# EAGLE design fuelboxmp3 (EAGLE 6.4)
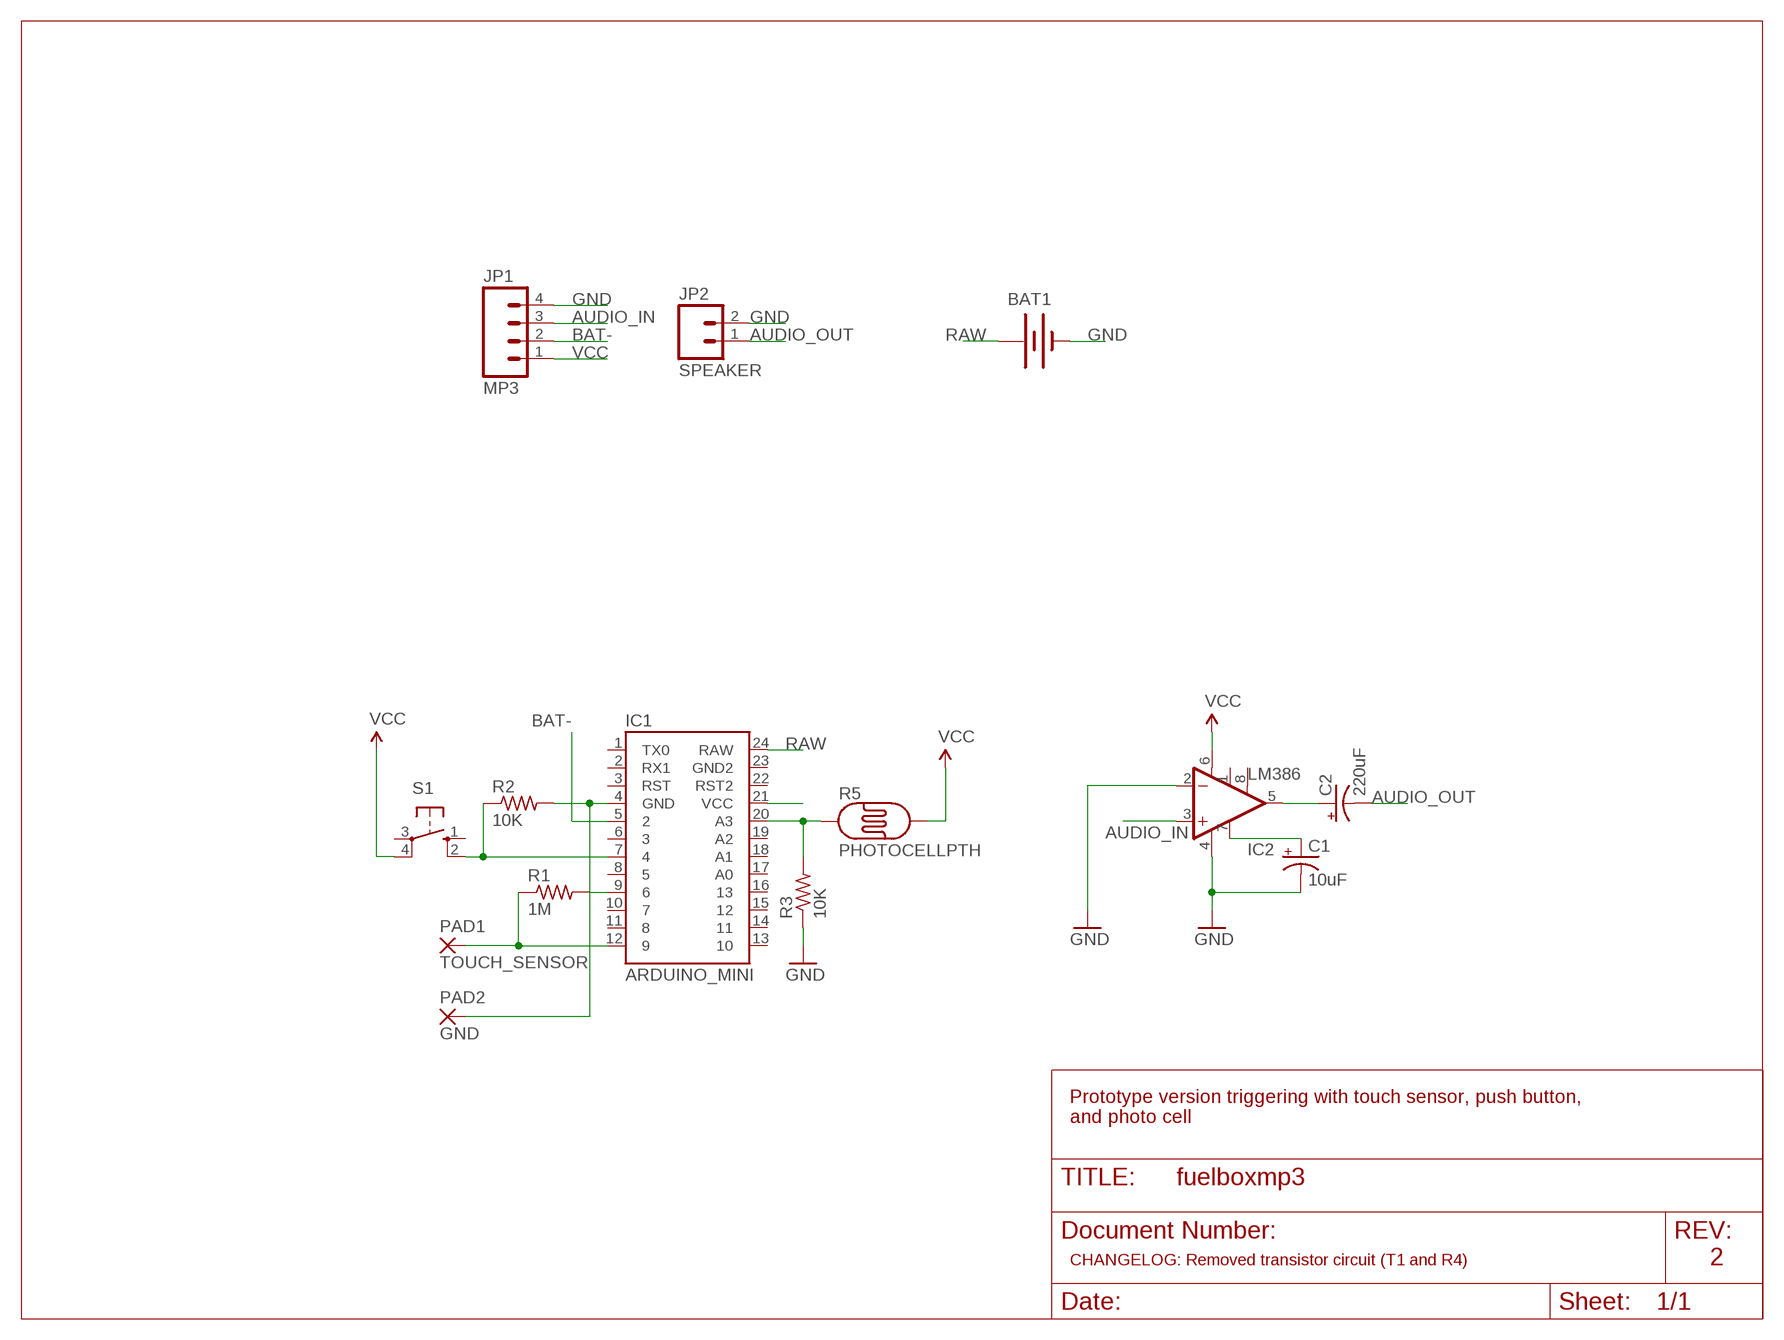
[diagram p0: schematic, sheet 1]

## Parts
BAT1  BATTERY1100  [LIPO-1100MAH]
C1  10uF  CPOL-USE2.5-5  [E2,5-5]
C2  220uF  CPOL-USE2.5-6  [E2,5-6]
IC1  ARDUINO_MINI  [ARDUINO_MINI]
IC2  LM386  [DIP08]
JP1  MP3  M04PTH  [1X04]
JP2  SPEAKER  M02PTH  [1X02]
PAD1  TOUCH_SENSOR  WIREPAD3,81/1,1  [3,81/1,1]
PAD2  GND  WIREPAD3,81/1,1  [3,81/1,1]
R1  1M  R-US_0204/7  [0204/7]
R2  10K  R-US_0204/7  [0204/7]
R3  10K  R-US_0204/7  [0204/7]
R5  PHOTOCELLPTH  [PHOTOCELL]
S1  10-XX  [B3F-10XX]

## Nets
AUDIO_IN: IC2.3(+IN) JP1.3
AUDIO_OUT: C2.- JP2.1
BAT-: IC1.5 JP1.2
GND: BAT1.- C1.- IC1.4(GND) IC2.2(-IN) IC2.4(V-) JP1.4 JP2.2 PAD2.1(P) R2.2 R3.1
N$1: IC1.9 R1.2
N$2: IC1.12 PAD1.1(P) R1.1
N$3: C2.+ IC2.5(OUT)
N$4: IC1.7 R2.1 S1.2(S1)
N$5: IC1.20(A3) R3.2 R5.1
N$8: C1.+ IC2.7(BP)
RAW: BAT1.+ IC1.24(RAW)
VCC: IC1.21(VCC) IC2.6(V+) JP1.1 R5.2 S1.4(P1)
Unconnected: IC1.1(TX0) IC1.2(RX1) IC1.3(RST) IC1.6 IC1.8 IC1.10 IC1.11 IC1.13 IC1.14 IC1.15 IC1.16 IC1.17(A0) IC1.18(A1) IC1.19(A2) IC1.22(RST2) IC1.23(GND2) IC2.1(GAIN) IC2.8(GAIN) S1.1(S) S1.3(P)

## Notes on the sheet
- Prototype version triggering with touch sensor, push button, 
  and photo cell
- CHANGELOG: Removed transistor circuit (T1 and R4) | 2

## Library data of the parts
BAT1 = SparkFun-Electromechanical:BATTERY: Battery Holders Various common sizes : AA, AAA, 20mm coin cell and 12mm coin cell. 20MM_4LEGS, BATT-10373
C1 C2 = rcl:CPOL-US: POLARIZED CAPACITOR, American symbol
IC1 = SparkFun-Boards:ARDUINO_MINI: Arduino Pro Mini footprint
IC2 = SparkFun-AnalogIC:LM386: low voltage audio power amplifier
JP1 = SparkFun-Connectors:M04: Header 4 Standard 4-pin 0.1" header. Use with straight break away headers (SKU : PRT-00116), right angle break away headers (PRT-00553), swiss pins (PRT-00743), machine pins (PRT-00117), and female headers (PRT-00115). Molex polarized connector foot print use with SKU : PRT-08231 with associated crimp pins and housings. 1MM SMD Version SKU: PRT-10208
JP2 = SparkFun-Connectors:M02: Standard 2-pin 0.1" header. Use with - straight break away headers ( PRT-00116) - right angle break away headers (PRT-00553) - swiss pins (PRT-00743) - machine pins (PRT-00117) - female headers (PRT-00115) Molex polarized connector foot print use with: PRT-08233 with associated crimp pins and housings. 2.54_SCREWTERM for use with PRT-10571. 3.5mm Screw Terminal footprints for PRT-08084 5mm Screw Terminal footprints for use with PRT-08433
PAD1 PAD2 = wirepad:WIREPAD: Wire PAD connect wire on PCB
R1-R3 = rcl:R-US_: RESISTOR, American symbol
R5 = SparkFun-Sensors:PHOTOCELL: CdS photoresistor. This is a low cost way to detect light levels. Resistance decreases with more incoming light. SparkFun SKU: SEN-09088
S1 = switch-omron:10-XX: OMRON SWITCH; MPN: B3F-1000; OC_FARNELL: 176432; OC_NEWARK: 36M3542

## Board
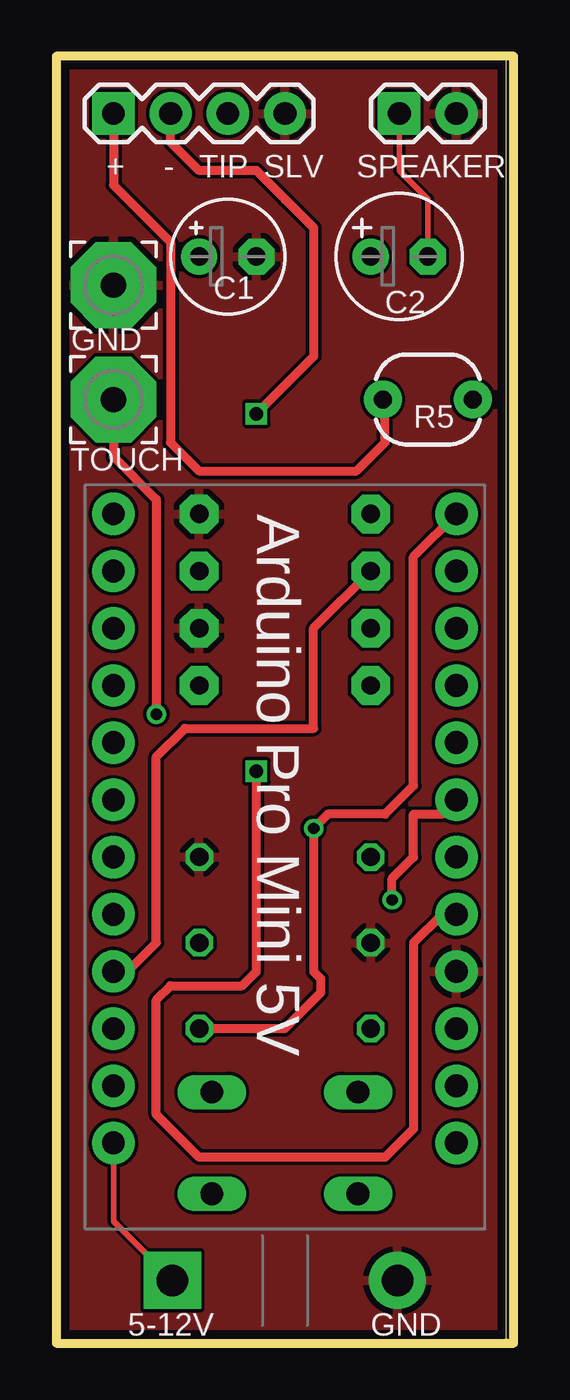
[diagram p1: board, top side]
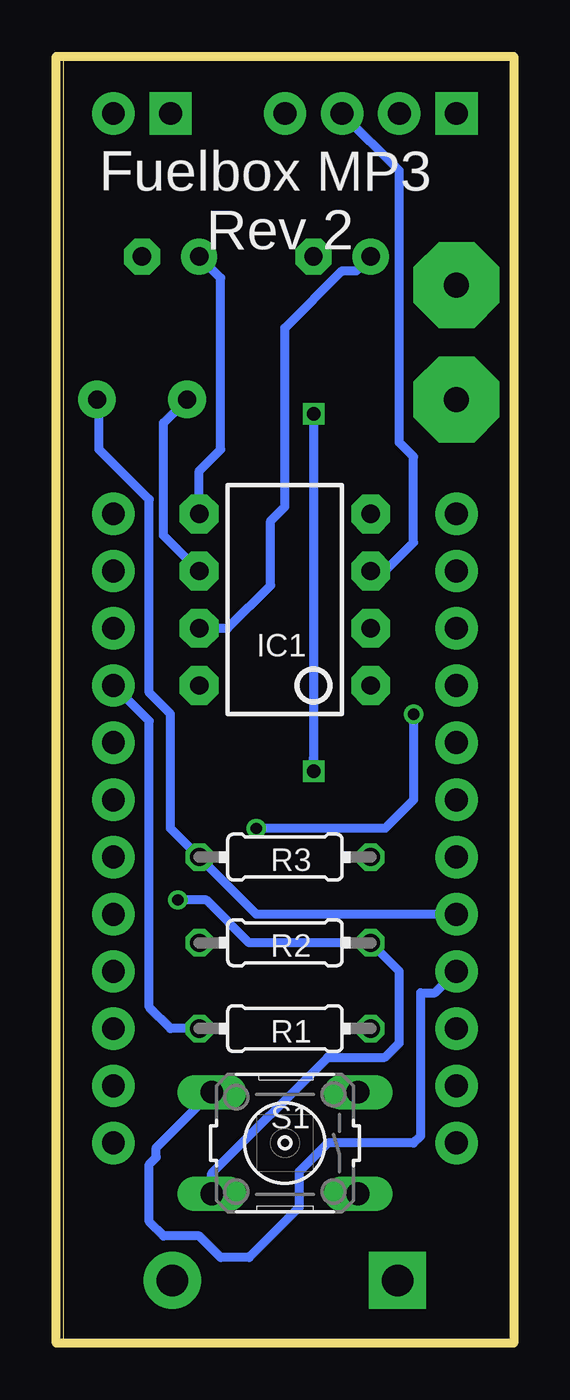
[diagram p2: board, bottom side, seen from below]

Size 20.32 x 57.15 mm. Coordinates in mm from the lower left corner, seen from the top.
Outline: 19.99,0 19.99,57.14 0,57.14
Outline: 0,57.14 0,57.15 20.32,57.15 20.32,0 19.99,0
Outline: 0,57.14 0,0 19.99,0
Copper layers (1*16): Top 0.0356mm / dielectric 1.5011mm / Bottom 0.0356mm
Design rules "LaenPCBOrder": minimum track width 6mil, minimum drill 13mil, track to track 6mil, track to pad 6mil, pad to pad 6mil, via to via 6mil, smd to smd 6mil, copper to edge 15mil, drill to drill 6mil, minimum pad ring 7mil, minimum via ring 7mil, stop-mask expansion 3mil, vias tented up to drill 0mil, thermal gap 10mil

### Footprints (pad centres in the part's own frame; a part is rotated, then mirrored left to right if it is on the bottom)
LIPO-1100MAH = drill 1.397 pad 2.54 square: + -5,32 | drill 1.397 pad 2.54: - 5,32
E2,5-5 = drill 0.813 pad 1.6: + -1.27,0 | drill 0.813 pad 1.6 octagon: - 1.27,0
E2,5-6 = drill 0.813 pad 1.6: + -1.27,0 | drill 0.813 pad 1.6 octagon: - 1.27,0
ARDUINO_MINI = drill 1.016 pad 1.88: 1 -7.62,12.7; 2 -7.62,10.16; 3 -7.62,7.62; 4 -7.62,5.08; 5 -7.62,2.54; 6 -7.62,0; 7 -7.62,-2.54; 8 -7.62,-5.08; 9 -7.62,-7.62; 10 -7.62,-10.16; 11 -7.62,-12.7; 12 -7.62,-15.24; 13 7.62,-15.24; 14 7.62,-12.7; 15 7.62,-10.16; 16 7.62,-7.62; 17 7.62,-5.08; 18 7.62,-2.54; 19 7.62,0; 20 7.62,2.54; 21 7.62,5.08; 22 7.62,7.62; 23 7.62,10.16; 24 7.62,12.7
DIP08 = drill 0.813 pad 1.727 octagon: 1 -3.81,-3.81; 2 -1.27,-3.81; 3 1.27,-3.81; 4 3.81,-3.81; 5 3.81,3.81; 6 1.27,3.81; 7 -1.27,3.81; 8 -3.81,3.81
1X04 = drill 1.016 pad 1.88 square: 1 0,0 | drill 1.016 pad 1.88: 2 2.54,0; 3 5.08,0; 4 7.62,0
1X02 = drill 1.016 pad 1.88 square: 1 0,0 | drill 1.016 pad 1.88: 2 2.54,0
3,81/1,1 = drill 1.118 pad 3.81 octagon: 1 0,0
0204/7 = drill 0.813 octagon: 1 -3.81,0; 2 3.81,0
PHOTOCELL = drill 0.8 pad 1.676: 1 -2,0; 2 2,0
B3F-10XX = drill 1.016 long: 1 -3.251,2.261; 2 3.251,2.261; 3 -3.251,-2.261; 4 3.251,-2.261

### Placement (x,y rotation side)
BAT1  10.16,-29.21 0 top
C1  7.62,48.26 0 top
C2  15.24,48.26 0 top
IC1  10.16,21.59 180 top
IC2  10.16,33.02 90 bottom
JP1  2.54,54.61 0 top
JP2  15.24,54.61 0 top
PAD1  2.54,41.91 180 top
PAD2  2.54,46.99 180 top
R1  10.16,13.97 180 bottom
R2  10.16,17.78 180 bottom
R3  10.16,21.59 180 bottom
R5  16.51,41.91 180 top
S1  10.16,8.89 180 bottom

### Tracks (layer width: path | path; a pad name or v marks a point on that pad's centre or on a via)
AUDIO_IN
  Bottom 0.406: IC2.3 5.71,34.29 4.45,35.56 4.45,39.37 5.08,40.01 5.08,52.07 JP1.3
AUDIO_OUT
  Top 0.254: JP2.1 15.24,52.07 16.51,50.8 C2.-
BAT-  (via drill 0.6)
  Top 0.406: JP1.2 5.08,53.34 6.35,52.07 8.89,52.07 10.16,50.8 11.43,49.53 11.43,43.81 v8.89,41.27 | IC1.5 17.14,19.05 15.88,17.78 15.88,9.53 14.61,8.26 6.35,8.26 4.45,10.16 4.45,15.24 5.08,15.88 8.26,15.88 8.89,16.51 8.89,22.86 8.89,24.77 v8.89,25.4
  Bottom 0.406: v8.89,41.27 8.89,26.04 | 8.89,26.04 v8.89,25.4 8.89,26.04
GND
  pour Top: 0,57.15 0,0 20.32,0 20.32,57.15
  pour Top: 0,57.15 0,0 20.32,0 20.32,57.15
N$1
  Bottom 0.406: R1.2 15.24,13.97 16.19,14.92 16.19,27.62 IC1.9
N$2  (via drill 0.51)
  Top 0.406: R1.1 10.16,13.97 11.75,15.56 11.75,16.19 11.43,16.51 v11.43,22.86 12.06,23.5 14.61,23.5 15.88,24.77 15.88,34.92 IC1.12 | PAD1.1 2.54,39.37 4.45,37.47 v4.45,27.94
  Bottom 0.406: v4.45,27.94 4.45,24.13 5.71,22.86 v11.43,22.86
N$3
  Bottom 0.406: IC2.5 13.97,38.73 13.02,39.69 13.02,47.31 C2.+
N$4  (via drill 0.51)
  Top 0.406: v14.92,19.68 14.92,20.64 15.88,21.59 15.88,23.5 17.14,23.5 IC1.7
  Bottom 0.406: S1.2 13.41,7.54 8.26,12.7 5.71,12.7 5.08,13.34 5.08,16.51 R2.1 11.75,17.78 13.65,19.68 v14.92,19.68
N$5
  Bottom 0.406: IC1.20 11.43,19.05 R3.2 15.24,22.86 15.24,27.94 16.19,28.89 16.19,37.47 18.41,39.69 18.41,41.81 R5.1
N$8
  Bottom 0.406: IC2.7 12.7,31.75 10.79,33.66 10.79,36.51 10.16,37.15 10.16,45.09 7.62,47.62 6.99,47.62 C1.+
RAW
  Top 0.254: IC1.24 2.54,5.41 BAT1.+
VCC
  Top 0.406: IC1.21 3.17,16.51 4.45,17.78 4.45,26.04 5.71,27.3 11.43,27.3 11.43,31.75 IC2.6 | JP1.1 2.54,51.44 5.08,48.9 5.08,40.01 6.35,38.73 13.34,38.73 14.61,40.01 14.61,41.81 R5.2 14.61,42.01
  Bottom 0.406: S1.4 15.88,8.69 15.88,8.26 16.19,7.94 16.19,5.4 15.56,4.76 13.97,4.76 13.02,3.81 11.75,3.81 9.53,6.03 9.53,7.62 8.26,8.89 4.45,8.89 4.13,9.21 4.13,15.56 3.49,15.56 IC1.21 | IC2.6 15.56,35.88 15.56,40.86 R5.2

### Text on the board
tPlace: + | - | TIP | SLV | SPEAKER | C1 | C2 | GND | R5 | TOUCH | Arduino Pro Mini 5V | 5-12V | GND
bPlace: Fuelbox MP3 | Rev 2 | IC1 | R3 | R2 | R1 | S1